# Altium schematic sheet Sheet4.SchDoc
size A3
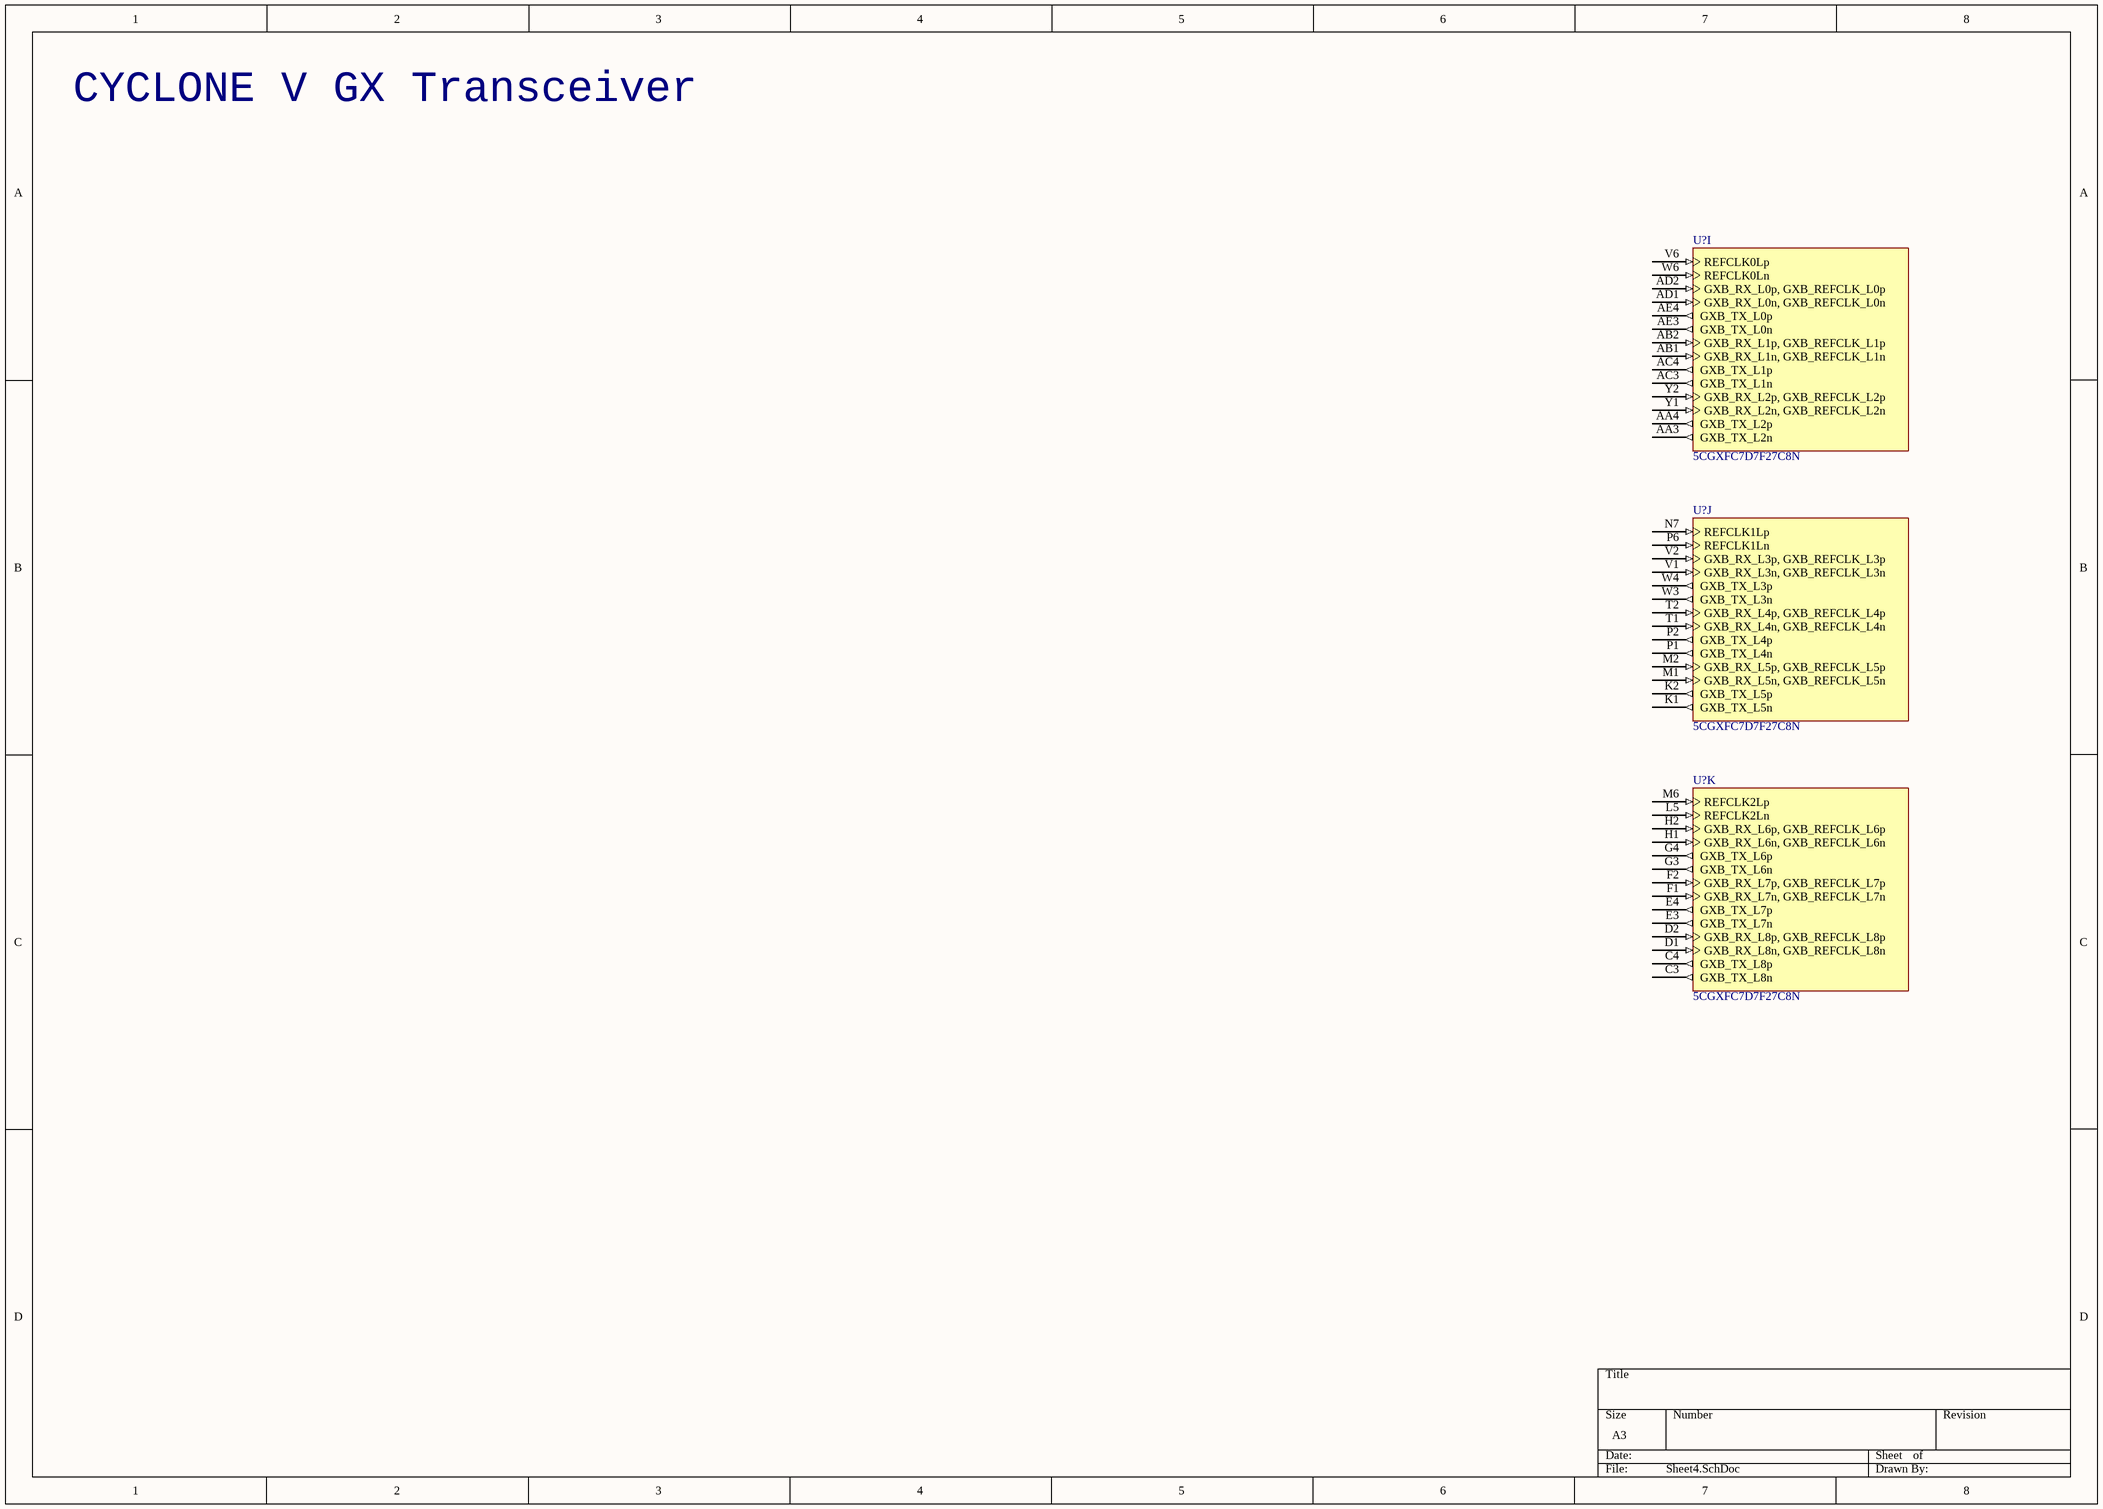
[diagram p0: Sheet4.SchDoc]

## Parts
(Parts that share a designator on the sheet are numbered #1, #2 ... from top to bottom, then left to right.)
U?#1  5CGXFC7D7F27C8N  [ALTR-672-FBGA-2000A]  (part I of 15)
U?#2  5CGXFC7D7F27C8N  [ALTR-672-FBGA-2000A]  (part J of 15)
U?#3  5CGXFC7D7F27C8N  [ALTR-672-FBGA-2000A]  (part K of 15)

## Nets

Not connected (* = marked no-connect by the designer): U?#1 AA3(GXB_TX_L2n) AA4(GXB_TX_L2p) AB1(GXB_RX_L1n,_GXB_REFCLK_L1n) AB2(GXB_RX_L1p,_GXB_REFCLK_L1p) AC3(GXB_TX_L1n) AC4(GXB_TX_L1p) AD1(GXB_RX_L0n,_GXB_REFCLK_L0n) AD2(GXB_RX_L0p,_GXB_REFCLK_L0p) AE3(GXB_TX_L0n) AE4(GXB_TX_L0p) V6(REFCLK0Lp) W6(REFCLK0Ln) Y1(GXB_RX_L2n,_GXB_REFCLK_L2n) Y2(GXB_RX_L2p,_GXB_REFCLK_L2p); U?#2 K1(GXB_TX_L5n) K2(GXB_TX_L5p) M1(GXB_RX_L5n,_GXB_REFCLK_L5n) M2(GXB_RX_L5p,_GXB_REFCLK_L5p) N7(REFCLK1Lp) P1(GXB_TX_L4n) P2(GXB_TX_L4p) P6(REFCLK1Ln) T1(GXB_RX_L4n,_GXB_REFCLK_L4n) T2(GXB_RX_L4p,_GXB_REFCLK_L4p) V1(GXB_RX_L3n,_GXB_REFCLK_L3n) V2(GXB_RX_L3p,_GXB_REFCLK_L3p) W3(GXB_TX_L3n) W4(GXB_TX_L3p); U?#3 C3(GXB_TX_L8n) C4(GXB_TX_L8p) D1(GXB_RX_L8n,_GXB_REFCLK_L8n) D2(GXB_RX_L8p,_GXB_REFCLK_L8p) E3(GXB_TX_L7n) E4(GXB_TX_L7p) F1(GXB_RX_L7n,_GXB_REFCLK_L7n) F2(GXB_RX_L7p,_GXB_REFCLK_L7p) G3(GXB_TX_L6n) G4(GXB_TX_L6p) H1(GXB_RX_L6n,_GXB_REFCLK_L6n) H2(GXB_RX_L6p,_GXB_REFCLK_L6p) L5(REFCLK2Ln) M6(REFCLK2Lp)

## Notes on the sheet
- CYCLONE V GX Transceiver

## Library data of the parts
U?#1-U?#3 = 5CGXFC7D7F27C8N: Cyclone V GX Family FPGA, 1.07 to 1.13 V Supply, 336 I/O Pins, 7 PLLs, 672-Pin FBGA, Speed Grade 8, Commercial Grade, RoHS Compliant; Manufacturer: Altera; GPIO: 336; Logic Elements (LE) (K): 149.5; Speed Grade: 8; DatasheetVersion: Rev. 3.1; PackageReference: 672-FBGA-2000A; PackageDescription: 672-Pin FineLine Ball-Grid Array (FBGA), Body 27 x 27 mm, Pitch 1 mm; Supplier 1: Digi-Key; Supplier Part Number 1: 544-2773-ND; Supplier 2: Mouser; Supplier Part Number 2: 989-5CGXFC7D7F27C8N; Device Group: 5CGXFC7; RoHS: RoHS Compliant; Subcategory: Cyclone V GX; Voltage Supply: 1.07 to 1.13 V; Mounting Technology: Surface Mount; Code_JEDEC: MS-034-AAL-1; PartNumber: 5CGXFC7D7F27C8N; ComponentLink1Description: Manufacturer URL; ComponentLink1URL: http://www.altera.com; ComponentLink2Description: Datasheet; ComponentLink2URL: http://www.altera.com/literature/hb/cyclone-v/cv_51002.pdf; ComponentLink3Description: Package Specification; ComponentLink3URL: http://www.altera.com/devicepackaging/04R00427-01.pdf; ComponentLink4Description: Device Handbook URL; ComponentLink4URL: http://www.altera.com/literature/hb/cyclone-v/cyclone5_handbook.pdf; ComponentLink5Description: Device Overview URL; ComponentLink5URL: http://www.altera.com/literature/hb/cyclone-v/cv_51001.pdf; ComponentLink6Description: Device Pin-Out URL; ComponentLink6URL: http://www.altera.com/literature/dp/cyclone-v/1.txt; ComponentLink7Description: Product URL; ComponentLink7URL: http://www.buyaltera.com/scripts/partsearch.dll?Detail&name=5CGXFC7D7F27C8N-ND